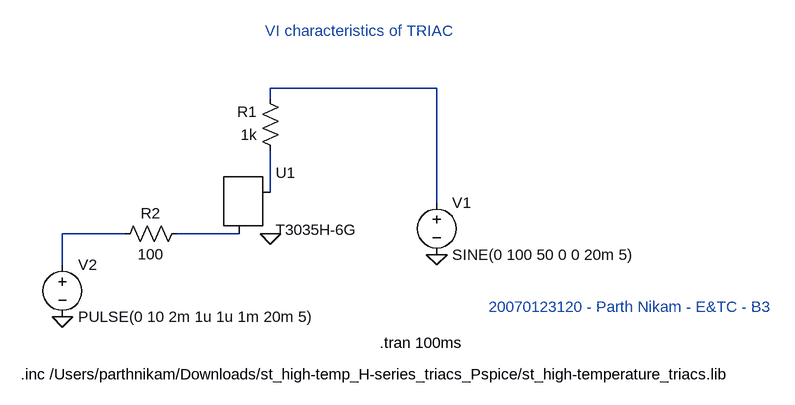
[diagram p0: schematic 3. TRIAC.asc]
3. TRIAC.asc, the LTspice schematic file:
Version 4
SHEET 1 1120 680
WIRE 592 96 336 96
WIRE 336 112 336 96
WIRE 336 256 336 192
WIRE 592 272 592 96
WIRE 112 320 16 320
WIRE 288 320 192 320
WIRE 16 368 16 320
FLAG 16 448 0
FLAG 336 320 0
FLAG 592 352 0
SYMBOL res 352 208 R180
WINDOW 0 36 76 Left 2
WINDOW 3 36 40 Left 2
SYMATTR InstName R1
SYMATTR Value 1k
SYMBOL res 96 336 R270
WINDOW 0 32 56 VTop 2
WINDOW 3 0 56 VBottom 2
SYMATTR InstName R2
SYMATTR Value 100
SYMBOL voltage 592 256 R0
SYMATTR InstName V1
SYMATTR Value SINE(0 100 50 0 0 20m 5)
SYMBOL voltage 16 352 R0
SYMATTR InstName V2
SYMATTR Value PULSE(0 10 2m 1u 1u 1m 20m 5)
SYMBOL Misc/TRIAC 304 256 R0
SYMATTR InstName U1
SYMATTR Value T3035H-6G
TEXT 504 488 Left 2 !.tran 100ms
TEXT -48 536 Left 2 !.inc /Users/parthnikam/Downloads/st_high-temp_H-series_triacs_Pspice/st_high-temperature_triacs.lib
TEXT 672 432 Left 2 ;20070123120 - Parth Nikam - E&TC - B3
TEXT 328 8 Left 2 ;VI characteristics of TRIAC

The netlist it stands for:
* 3. TRIAC.asc
R1 N002 N001 1k
R2 N003 N004 100
V1 N001 0 SINE(0 100 50 0 0 20m 5)
V2 N003 0 PULSE(0 10 2m 1u 1u 1m 20m 5)
XU1 N002 N004 0 T3035H-6G  ; pins MT2 G MT1
.tran 100ms
.inc /Users/parthnikam/Downloads/st_high-temp_H-series_triacs_Pspice/st_high-temperature_triacs.lib
* 20070123120 - Parth Nikam - E&TC - B3
* VI characteristics of TRIAC
.backanno
.end